# Altium project DAQBOXRev2.2026.PrjPcb
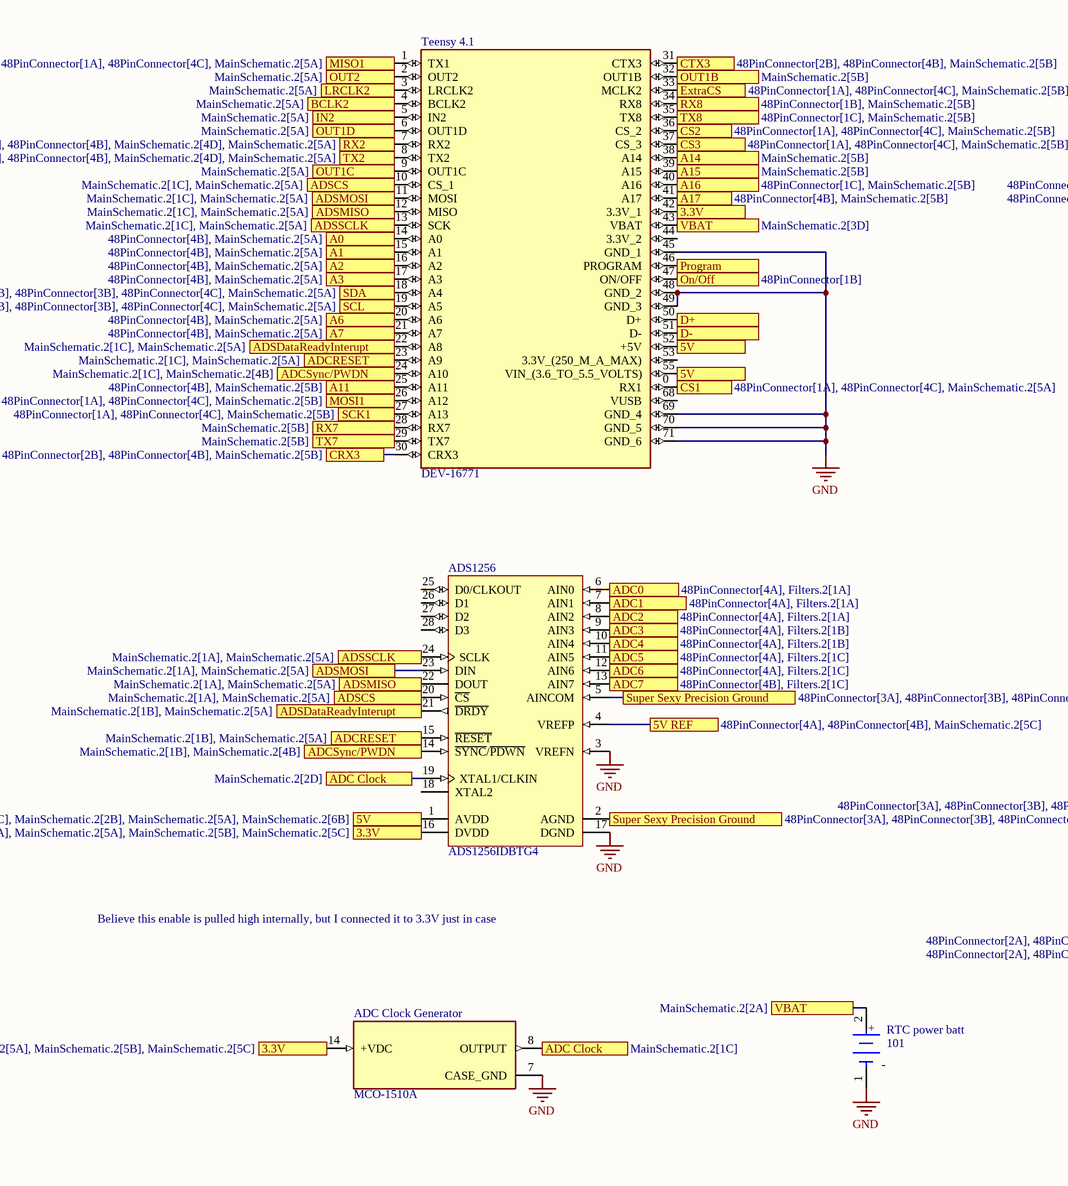
[diagram p0: MainSchematic.2.SchDoc, left]
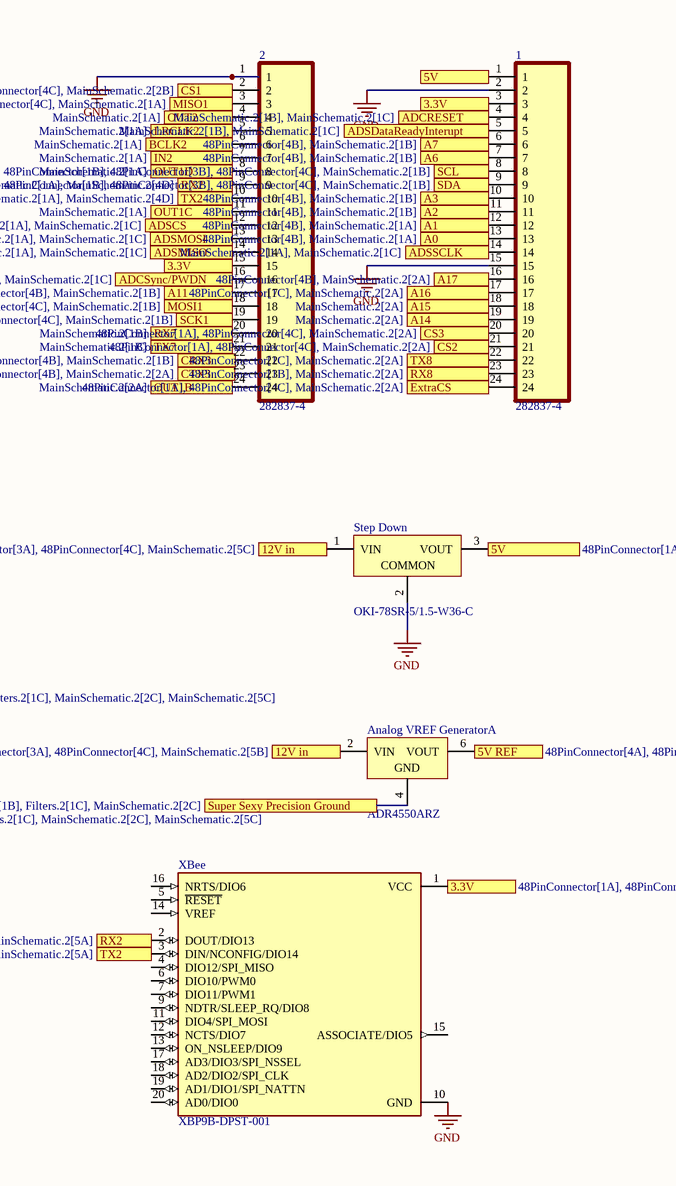
[diagram p1: MainSchematic.2.SchDoc, right]
3 sheets, 48 parts. Net scope: flat (ports and power ports of the same name join across sheets).
Board files: PCB2.FINAL.PcbDoc, PCB2.TEST.PcbDoc, PCB2.2.PcbDoc
Sheets:
  MainSchematic.2.SchDoc
  Filters.2.SchDoc
  48PinConnector.SchDoc

## Sheet MainSchematic.2.SchDoc
size OrCAD B; SheetNumber: 1; SheetTotal: 3

### Parts
1  282837-4  [TE_282837-4]
2  282837-4  [TE_282837-4]
ADC_Clock_Generator  MCO-1510A  [OSC_ECS-100AX-500]
ADS1256  ADS1256IDBTG4  [TI-DB28_L]
Analog_VREF_Generator  ADR4550ARZ  [ADI-R-8_N]  (part A of 2)
RTC_power_batt  101  [FP-101-MFG]
Step_Down  OKI-78SR-5/1.5-W36-C  [MURA-OKI-78SR-3]
Teensy_4.1  DEV-16771  [MODULE_DEV-16771]
XBee  XBP9B-DPST-001  [DIP2200W51P200L3294H279Q20P]

### Ports
3.3V (see 48PinConnector[1A], 48PinConnector[2B], 48PinConnector[2D], 48PinConnector[4C], MainSchematic.2[1C], MainSchematic.2[1D], MainSchematic.2[2A], MainSchematic.2[5A], MainSchematic.2[5B]), 3.3V (see 48PinConnector[1A], 48PinConnector[2B], 48PinConnector[2D], 48PinConnector[4C], MainSchematic.2[1C], MainSchematic.2[1D], MainSchematic.2[2A], MainSchematic.2[5A], MainSchematic.2[5C]), 3.3V (see 48PinConnector[1A], 48PinConnector[2B], 48PinConnector[2D], 48PinConnector[4C], MainSchematic.2[1C], MainSchematic.2[1D], MainSchematic.2[2A], MainSchematic.2[5B], MainSchematic.2[5C]), 3.3V (see 48PinConnector[1A], 48PinConnector[2B], 48PinConnector[2D], 48PinConnector[4C], MainSchematic.2[1C], MainSchematic.2[1D], MainSchematic.2[5A], MainSchematic.2[5B], MainSchematic.2[5C]), 3.3V (see 48PinConnector[1A], 48PinConnector[2B], 48PinConnector[2D], 48PinConnector[4C], MainSchematic.2[1C], MainSchematic.2[2A], MainSchematic.2[5A], MainSchematic.2[5B], MainSchematic.2[5C]), 3.3V (see 48PinConnector[1A], 48PinConnector[2B], 48PinConnector[2D], 48PinConnector[4C], MainSchematic.2[1D], MainSchematic.2[2A], MainSchematic.2[5A], MainSchematic.2[5B], MainSchematic.2[5C]), 5V (see 48PinConnector[1A], 48PinConnector[1B], 48PinConnector[1D], 48PinConnector[2A], 48PinConnector[3B], 48PinConnector[4B], 48PinConnector[4C], MainSchematic.2[1C], MainSchematic.2[2B], MainSchematic.2[5A]), 5V (see 48PinConnector[1A], 48PinConnector[1B], 48PinConnector[1D], 48PinConnector[2A], 48PinConnector[3B], 48PinConnector[4B], 48PinConnector[4C], MainSchematic.2[1C], MainSchematic.2[2B], MainSchematic.2[5A], MainSchematic.2[6B]), 5V (see 48PinConnector[1A], 48PinConnector[1B], 48PinConnector[1D], 48PinConnector[2A], 48PinConnector[3B], 48PinConnector[4B], 48PinConnector[4C], MainSchematic.2[1C], MainSchematic.2[2B], MainSchematic.2[6B]), 5V (see 48PinConnector[1A], 48PinConnector[1B], 48PinConnector[1D], 48PinConnector[2A], 48PinConnector[3B], 48PinConnector[4B], 48PinConnector[4C], MainSchematic.2[2B], MainSchematic.2[5A], MainSchematic.2[6B]), 5V REF (see 48PinConnector[4A], 48PinConnector[4B], MainSchematic.2[2C]), 5V REF (see 48PinConnector[4A], 48PinConnector[4B], MainSchematic.2[5C]), 12V in (see 48PinConnector[2D], 48PinConnector[3A], 48PinConnector[4C], MainSchematic.2[5B]), 12V in (see 48PinConnector[2D], 48PinConnector[3A], 48PinConnector[4C], MainSchematic.2[5C]), A0 (see 48PinConnector[4B], MainSchematic.2[1A]), A0 (see 48PinConnector[4B], MainSchematic.2[5A]), A1 (see 48PinConnector[4B], MainSchematic.2[1A]), A1 (see 48PinConnector[4B], MainSchematic.2[5A]), A2 (see 48PinConnector[4B], MainSchematic.2[1B]), A2 (see 48PinConnector[4B], MainSchematic.2[5A]), A3 (see 48PinConnector[4B], MainSchematic.2[1B]), A3 (see 48PinConnector[4B], MainSchematic.2[5A]), A6 (see 48PinConnector[4B], MainSchematic.2[1B]), A6 (see 48PinConnector[4B], MainSchematic.2[5A]), A7 (see 48PinConnector[4B], MainSchematic.2[1B]), A7 (see 48PinConnector[4B], MainSchematic.2[5A]), A11 (see 48PinConnector[4B], MainSchematic.2[1B]), A11 (see 48PinConnector[4B], MainSchematic.2[5B]), A14 (see MainSchematic.2[2A]), A14 (see MainSchematic.2[5B]), A15 (see MainSchematic.2[2A]), A15 (see MainSchematic.2[5B]), A16 (see 48PinConnector[1C], MainSchematic.2[2A]), A16 (see 48PinConnector[1C], MainSchematic.2[5B]), A17 (see 48PinConnector[4B], MainSchematic.2[2A]), A17 (see 48PinConnector[4B], MainSchematic.2[5B]), ADC0 (see 48PinConnector[4A], Filters.2[1A]), ADC1 (see 48PinConnector[4A], Filters.2[1A]), ADC2 (see 48PinConnector[4A], Filters.2[1A]), ADC3 (see 48PinConnector[4A], Filters.2[1B]), ADC4 (see 48PinConnector[4A], Filters.2[1B]), ADC5 (see 48PinConnector[4A], Filters.2[1C]), ADC6 (see 48PinConnector[4A], Filters.2[1C]), ADC7 (see 48PinConnector[4B], Filters.2[1C]), ADC Clock (see MainSchematic.2[1C]), ADC Clock (see MainSchematic.2[2D]), ADCRESET (see MainSchematic.2[1B], MainSchematic.2[1C]), ADCRESET (see MainSchematic.2[1B], MainSchematic.2[5A]), ADCRESET (see MainSchematic.2[1C], MainSchematic.2[5A]), ADCSync/PWDN (see MainSchematic.2[1B], MainSchematic.2[1C]), ADCSync/PWDN (see MainSchematic.2[1B], MainSchematic.2[4B]), ADCSync/PWDN (see MainSchematic.2[1C], MainSchematic.2[4B]), ADSCS (see MainSchematic.2[1A], MainSchematic.2[1C]), ADSCS (see MainSchematic.2[1A], MainSchematic.2[5A]), ADSCS (see MainSchematic.2[1C], MainSchematic.2[5A]), ADSDataReadyInterupt (see MainSchematic.2[1B], MainSchematic.2[1C]), ADSDataReadyInterupt (see MainSchematic.2[1B], MainSchematic.2[5A]), ADSDataReadyInterupt (see MainSchematic.2[1C], MainSchematic.2[5A]), ADSMISO (see MainSchematic.2[1A], MainSchematic.2[1C]), ADSMISO (see MainSchematic.2[1A], MainSchematic.2[5A]), ADSMISO (see MainSchematic.2[1C], MainSchematic.2[5A]), ADSMOSI (see MainSchematic.2[1A], MainSchematic.2[1C]), ADSMOSI (see MainSchematic.2[1A], MainSchematic.2[5A]), ADSMOSI (see MainSchematic.2[1C], MainSchematic.2[5A]), ADSSCLK (see MainSchematic.2[1A], MainSchematic.2[1C]), ADSSCLK (see MainSchematic.2[1A], MainSchematic.2[5A]), ADSSCLK (see MainSchematic.2[1C], MainSchematic.2[5A]), BCLK2 (see MainSchematic.2[1A]), BCLK2 (see MainSchematic.2[5A]), CRX3 (see 48PinConnector[2B], 48PinConnector[4B], MainSchematic.2[1B]), CRX3 (see 48PinConnector[2B], 48PinConnector[4B], MainSchematic.2[5B]), CS1 (see 48PinConnector[1A], 48PinConnector[4C], MainSchematic.2[2B]), CS1 (see 48PinConnector[1A], 48PinConnector[4C], MainSchematic.2[5A]), CS2 (see 48PinConnector[1A], 48PinConnector[4C], MainSchematic.2[2A]), CS2 (see 48PinConnector[1A], 48PinConnector[4C], MainSchematic.2[5B]), CS3 (see 48PinConnector[1A], 48PinConnector[4C], MainSchematic.2[2A]), CS3 (see 48PinConnector[1A], 48PinConnector[4C], MainSchematic.2[5B]), CTX3 (see 48PinConnector[2B], 48PinConnector[4B], MainSchematic.2[2A]), CTX3 (see 48PinConnector[2B], 48PinConnector[4B], MainSchematic.2[5B]), D+, D-, ExtraCS (see 48PinConnector[1A], 48PinConnector[4C], MainSchematic.2[2A]), ExtraCS (see 48PinConnector[1A], 48PinConnector[4C], MainSchematic.2[5B]), IN2 (see MainSchematic.2[1A]), IN2 (see MainSchematic.2[5A]), LRCLK2 (see MainSchematic.2[1A]), LRCLK2 (see MainSchematic.2[5A]), MISO1 (see 48PinConnector[1A], 48PinConnector[4C], MainSchematic.2[1A]), MISO1 (see 48PinConnector[1A], 48PinConnector[4C], MainSchematic.2[5A]), MOSI1 (see 48PinConnector[1A], 48PinConnector[4C], MainSchematic.2[1B]), MOSI1 (see 48PinConnector[1A], 48PinConnector[4C], MainSchematic.2[5B]), On/Off (see 48PinConnector[1B]), OUT1B (see MainSchematic.2[2A]), OUT1B (see MainSchematic.2[5B]), OUT1C (see MainSchematic.2[1A]), OUT1C (see MainSchematic.2[5A]), OUT1D (see MainSchematic.2[1A]), OUT1D (see MainSchematic.2[5A]), OUT2 (see MainSchematic.2[1A]), OUT2 (see MainSchematic.2[5A]), Program, RX2 (see 48PinConnector[2A], 48PinConnector[4B], MainSchematic.2[1A], MainSchematic.2[4D]), RX2 (see 48PinConnector[2A], 48PinConnector[4B], MainSchematic.2[1A], MainSchematic.2[5A]), RX2 (see 48PinConnector[2A], 48PinConnector[4B], MainSchematic.2[4D], MainSchematic.2[5A]), RX7 (see MainSchematic.2[1B]), RX7 (see MainSchematic.2[5B]), RX8 (see 48PinConnector[1B], MainSchematic.2[2A]), RX8 (see 48PinConnector[1B], MainSchematic.2[5B]), SCK1 (see 48PinConnector[1A], 48PinConnector[4C], MainSchematic.2[1B]), SCK1 (see 48PinConnector[1A], 48PinConnector[4C], MainSchematic.2[5B]), SCL (see 48PinConnector[1B], 48PinConnector[3B], 48PinConnector[4C], MainSchematic.2[1B]), SCL (see 48PinConnector[1B], 48PinConnector[3B], 48PinConnector[4C], MainSchematic.2[5A]), SDA (see 48PinConnector[1B], 48PinConnector[3B], 48PinConnector[4C], MainSchematic.2[1B]), SDA (see 48PinConnector[1B], 48PinConnector[3B], 48PinConnector[4C], MainSchematic.2[5A]), Super Sexy Precision Ground (see 48PinConnector[3A], 48PinConnector[3B], 48PinConnector[3C], Filters.2[1A], Filters.2[1B], Filters.2[1C], MainSchematic.2[2C]), Super Sexy Precision Ground (see 48PinConnector[3A], 48PinConnector[3B], 48PinConnector[3C], Filters.2[1A], Filters.2[1B], Filters.2[1C], MainSchematic.2[2C], MainSchematic.2[5C]), TX2 (see 48PinConnector[2A], 48PinConnector[4B], MainSchematic.2[1A], MainSchematic.2[4D]), TX2 (see 48PinConnector[2A], 48PinConnector[4B], MainSchematic.2[1A], MainSchematic.2[5A]), TX2 (see 48PinConnector[2A], 48PinConnector[4B], MainSchematic.2[4D], MainSchematic.2[5A]), TX7 (see MainSchematic.2[1B]), TX7 (see MainSchematic.2[5B]), TX8 (see 48PinConnector[1C], MainSchematic.2[2A]), TX8 (see 48PinConnector[1C], MainSchematic.2[5B]), VBAT (see MainSchematic.2[2A]), VBAT (see MainSchematic.2[3D])

### Nets
GND: 1.2 1.15 2.1 ADC_Clock_Generator.7(CASE_GND) ADS1256.3(VREFN) ADS1256.17(DGND) RTC_power_batt.1(C) Step_Down.2(COMMON) Teensy_4.1.45(GND_1) Teensy_4.1.48(GND_2) Teensy_4.1.49(GND_3) Teensy_4.1.69(GND_4) Teensy_4.1.70(GND_5) Teensy_4.1.71(GND_6) XBee.10(GND)
Net1_1: 1.1 ADS1256.1(AVDD) Step_Down.3(VOUT) Teensy_4.1.52(+5V) Teensy_4.1.55(VIN_(3.6_TO_5.5_VOLTS)) ; port 5V
Net1_3: 1.3 2.15 ADC_Clock_Generator.14(+VDC) ADS1256.16(DVDD) Teensy_4.1.42(3.3V_1) XBee.1(VCC) ; port 3.3V
Net1_4: 1.4 ADS1256.15(~{RESET}) Teensy_4.1.23(A9) ; port ADCRESET
Net1_5: 1.5 ADS1256.21(~{DRDY}) Teensy_4.1.22(A8) ; port ADSDataReadyInterupt
Net1_6: 1.6 Teensy_4.1.21(A7) ; port A7
Net1_7: 1.7 Teensy_4.1.20(A6) ; port A6
Net1_8: 1.8 Teensy_4.1.19(A5) ; port SCL
Net1_9: 1.9 Teensy_4.1.18(A4) ; port SDA
Net1_10: 1.10 Teensy_4.1.17(A3) ; port A3
Net1_11: 1.11 Teensy_4.1.16(A2) ; port A2
Net1_12: 1.12 Teensy_4.1.15(A1) ; port A1
Net1_13: 1.13 Teensy_4.1.14(A0) ; port A0
Net1_14: 1.14 ADS1256.24(SCLK) Teensy_4.1.13(SCK) ; port ADSSCLK
Net1_16: 1.16 Teensy_4.1.41(A17) ; port A17
Net1_17: 1.17 Teensy_4.1.40(A16) ; port A16
Net1_18: 1.18 Teensy_4.1.39(A15) ; port A15
Net1_19: 1.19 Teensy_4.1.38(A14) ; port A14
Net1_20: 1.20 Teensy_4.1.37(CS_3) ; port CS3
Net1_21: 1.21 Teensy_4.1.36(CS_2) ; port CS2
Net1_22: 1.22 Teensy_4.1.35(TX8) ; port TX8
Net1_23: 1.23 Teensy_4.1.34(RX8) ; port RX8
Net1_24: 1.24 Teensy_4.1.33(MCLK2) ; port ExtraCS
Net2_2: 2.2 Teensy_4.1.0(RX1) ; port CS1
Net2_3: 2.3 Teensy_4.1.1(TX1) ; port MISO1
Net2_4: 2.4 Teensy_4.1.2(OUT2) ; port OUT2
Net2_5: 2.5 Teensy_4.1.3(LRCLK2) ; port LRCLK2
Net2_6: 2.6 Teensy_4.1.4(BCLK2) ; port BCLK2
Net2_7: 2.7 Teensy_4.1.5(IN2) ; port IN2
Net2_8: 2.8 Teensy_4.1.6(OUT1D) ; port OUT1D
Net2_9: 2.9 Teensy_4.1.7(RX2) XBee.2(DOUT/DIO13) ; port RX2
Net2_10: 2.10 Teensy_4.1.8(TX2) XBee.3(DIN/NCONFIG/DIO14) ; port TX2
Net2_11: 2.11 Teensy_4.1.9(OUT1C) ; port OUT1C
Net2_12: 2.12 ADS1256.20(~{CS}) Teensy_4.1.10(CS_1) ; port ADSCS
Net2_13: 2.13 ADS1256.23(DIN) Teensy_4.1.11(MOSI) ; port ADSMOSI
Net2_14: 2.14 ADS1256.22(DOUT) Teensy_4.1.12(MISO) ; port ADSMISO
Net2_16: 2.16 ADS1256.14(~{SYNC}/~{PDWN}) Teensy_4.1.24(A10) ; port ADCSync/PWDN
Net2_17: 2.17 Teensy_4.1.25(A11) ; port A11
Net2_18: 2.18 Teensy_4.1.26(A12) ; port MOSI1
Net2_19: 2.19 Teensy_4.1.27(A13) ; port SCK1
Net2_20: 2.20 Teensy_4.1.28(RX7) ; port RX7
Net2_21: 2.21 Teensy_4.1.29(TX7) ; port TX7
Net2_24: 2.24 Teensy_4.1.32(OUT1B) ; port OUT1B
Net12V_1: Analog_VREF_Generator.2(VIN) Step_Down.1(VIN) ; port 12V in
Net48_Pin_Conn_A1: ADS1256.4(VREFP) Analog_VREF_Generator.6(VOUT) ; port 5V REF
Net48_Pin_Conn_A3: Teensy_4.1.30(CRX3) ; port CRX3
Net48_Pin_Conn_B1: ADS1256.2(AGND) ADS1256.5(AINCOM) Analog_VREF_Generator.4(GND) ; port Super Sexy Precision Ground
Net48_Pin_Conn_B3: Teensy_4.1.31(CTX3) ; port CTX3
Net48_Pin_Conn_C1: ADS1256.6(AIN0) ; port ADC0
Net48_Pin_Conn_D1: ADS1256.7(AIN1) ; port ADC1
Net48_Pin_Conn_E1: ADS1256.8(AIN2) ; port ADC2
Net48_Pin_Conn_F1: ADS1256.9(AIN3) ; port ADC3
Net48_Pin_Conn_G1: ADS1256.10(AIN4) ; port ADC4
Net48_Pin_Conn_H1: ADS1256.11(AIN5) ; port ADC5
Net48_Pin_Conn_J1: ADS1256.12(AIN6) ; port ADC6
Net48_Pin_Conn_K1: ADS1256.13(AIN7) ; port ADC7
NetADC_Clock_Generator_8: ADC_Clock_Generator.8(OUTPUT) ADS1256.19(XTAL1/CLKIN) ; port ADC Clock
NetI/O_1: Teensy_4.1.47(ON/OFF) ; port On/Off
NetRTC_power_batt_2: RTC_power_batt.2(A) Teensy_4.1.43(VBAT) ; port VBAT
NetTeensy_4.1_46: Teensy_4.1.46(PROGRAM) ; port Program
NetTeensy_4.1_50: Teensy_4.1.50(D+) ; port D+
NetTeensy_4.1_51: Teensy_4.1.51(D-) ; port D-

Not connected (* = marked no-connect by the designer): 2 22 23; ADS1256 18(XTAL2) 25(D0/CLKOUT) 26(D1) 27(D2) 28(D3); Teensy_4.1 44(3.3V_2) 53(3.3V_(250_M_A_MAX)) 68(VUSB); XBee 4(DIO12/SPI_MISO) 5(~{RESET}) 6(DIO10/PWM0) 7(DIO11/PWM1) 9(NDTR/SLEEP_RQ/DIO8) 11(DIO4/SPI_MOSI) 12(NCTS/DIO7) 13(ON_NSLEEP/DIO9) 14(VREF) 15(ASSOCIATE/DIO5) 16(NRTS/DIO6) 17(AD3/DIO3/SPI_NSSEL) 18(AD2/DIO2/SPI_CLK) 19(AD1/DIO1/SPI_NATTN) 20(AD0/DIO0)

### Notes on the sheet
- Believe this enable is pulled high internally, but I connected it to 3.3V just in case
- (in symbol CMP-19636-000018-1) +

### Library data of the parts
1 2 = 282837-4: 4 Position Wire to Board Terminal Block Horizontal with Board 0.200 (5.08mm) Through Hole; MF: TE Connectivity; Value: *; SnapEDA_Link: https://www.snapeda.com/parts/282837-4/TE+Connectivity+AMP+Connectors/view-part/?ref=snap; Purchase-URL: https://pricing.snapeda.com/search/part/282837-4/?ref=eda; EU_RoHS_Compliance: Compliant with Exemptions; Availability: In Stock; Price: None; Package: None; Check_prices: https://www.snapeda.com/parts/282837-4/TE+Connectivity+AMP+Connectors/view-part/?ref=eda; MP: 282837-4
ADC_Clock_Generator = ECS-100AX-500: Oscillator  14-DIP, 4 Leads (Full Size, Metal Can); Package: None; Price: None; Value: *; MP: ECS-100AX-500; Availability: Unavailable
ADS1256 = CMP-0003-00153-1: 24-Bit, 30 kSPS Very Low Noise Delta-Sigma ADC with Multiplexer, -40 to 85 degC, 28-pin SOP (DB28), Green (RoHS & no Sb/Br); Manufacturer: Texas Instruments; SubFamily: Precision ADC (<=10MSPS); Analog Voltage AV/DD(Min)(V): 4.75; Digital Supply(Max)(V): 3.6; Digital Supply(Min)(V): 1.8; Resolution(Bits): 24; Analog Voltage AV/DD(Max)(V): 5.25; Sample Rate (max)(SPS): 30k; # Input Channels: 8; Interface: Serial SPI; Mounting Technology: Surface Mount; Architecture: Delta-Sigma; DatasheetVersion: SBAS288J; ComponentLink3Description: Package Specification; Eco-Plan: Green (RoHS & no Sb/Br); Code_JEDEC: MO-150; PackageDescription: 28-Pin Plastic Small Outline, Body 10.2 X 5.3 mm, Pitch 0.65 mm; ComponentLink3URL: http://www.ti.com/lit/ml/msso002e/msso002e.pdf; ComponentLink1Description: Manufacturer URL; ComponentLink1URL: http://www.ti.com/; PartNumber: ADS1256IDBTG4; ComponentLink2URL: http://www.ti.com/general/docs/lit/getliterature.tsp?genericPartNumber=ADS1256&fileType=pdf; PackageReference: DB28; PackageVersion: 4040065/E, 12/2001; ComponentLink2Description: Datasheet
Analog_VREF_Generator = CMP-0784-00194-1: Ultralow Noise, High Accuracy Voltage Reference, 5 V Output, 3 to 15 V Supply, Industrial, 8-pin SOIC (R-8), Tube; Manufacturer: Analog Devices; Vout: 5V; Max V Supply (V): 15; Min V Supply (V): 3; Ref Out TC (ppm/C): 4; PackageReference: R-8; PackageDescription: 8-Pin Standard Small Outline Package, Body 4.9 x 3.9 mm, Pitch 1.27 mm; PackageVersion: 060506-A, 06/2006; Operating Temp Range: -40 to 125 degC; DatasheetVersion: Rev. 0; ComponentLink1URL: http://www.analog.com/en/index.html; PartNumber: ADR4550ARZ; Mounting Technology: Surface Mount; ComponentLink2URL: http://www.analog.com/static/imported-files/data_sheets/ADR4520_4525_4530_4533_4540_4550.pdf; ComponentLink2Description: Datasheet; ComponentLink3Description: Package Specification; ComponentLink3URL: http://www.analog.com/static/imported-files/packages/PKG_PDF/SOIC_Narrow%20(R)/R_8.pdf; Packing: Tube; ComponentLink1Description: Manufacturer URL; Code_JEDEC: MS-012-AA; ComponentLink4Description: URL Link1; ComponentLink4URL: Product URL:http://www.analog.com/en/special-linear-functions/voltage-references/adr4550/products/product.html
RTC_power_batt = CMP-19636-000018-1: BATTERY HOLDER COIN 20MM PC PIN; Body Material: PBT; Number of Batteries: 1; Packaging: Bag; Lead Free: Lead Free; Package Quantity: 1; Contact Plating: Tin; Termination: PC Pin; REACH SVHC: No SVHC; Material: Steel; Mount: Through Hole; Max Operating Temperature: 145°C; Min Operating Temperature: -50°C; Number of Cells: 1; Series: -
Step_Down = CMP-2000-05274-1: Non-Isolated DC/DC Converter, 7.5 W, 7 to 36 V, 1.5 A, -40 to 85 degC, 3-Pin THD, RoHS; Manufacturer: Murata; Current - Output (Max): 1.5A; Power (Watts) - Max: 8W; Efficiency: 90.5%; Voltage - Input (Min): 7V; Voltage - Input (Max): 36V; Voltage - Output 1: 5V; Number of Outputs: 1; Package / Case: 3-SIPModule; Features: SCP; Type: LinearRegulatorReplacement; Size / Dimension: 0.41"Lx0.30"Wx0.65"H(10.4mmx7.6mmx16.5mm); Datasheet URL: https://datasheet.ciiva.com/8006/1790439-8006672.pdf; Datasheet Version: Oct-13; Power (Watts) - Manufacture Series: 8W; Voltage - Output 2: -; Series: Okami™OKI-78SR; Family: DCDCConverters; Manufacturer URL: http://www.murata.com/; Category: PowerSupplies-BoardMount; Voltage - Isolation: -; Packaging: Tube; Applications: ITE(Commercial); Mounting Type: ThroughHole; Voltage - Output 3: -; Operating Temperature: -40degC~85degC
Teensy_4.1 = CMP-003-000000-1: RT1062 Teensy 4.1 series ARM?Cortex?M7 MPU Embedded Evaluation Board; MF: SparkFun Electronics; SnapEDA_Link: https://www.snapeda.com/parts/DEV-16771/SparkFun+Electronics/view-part/?ref=snap; Package: None; Value: *; MP: DEV-16771; Check_prices: https://www.snapeda.com/parts/DEV-16771/SparkFun+Electronics/view-part/?ref=eda
XBee = XBP9B-DPST-001: General ISM < 1GHz - Transceiver Module 900MHz Antenna Not Included, RP-SMA Through Hole; MF: Digi International; SnapEDA_Link: https://www.snapeda.com/parts/XBP9B-DPST-001/Digi+International/view-part/?ref=snap; Package: Module Digi International; Value: *; MP: XBP9B-DPST-001; Check_prices: https://www.snapeda.com/parts/XBP9B-DPST-001/Digi+International/view-part/?ref=eda

## Sheet Filters.2.SchDoc
size A; SheetNumber: 2; SheetTotal: 3
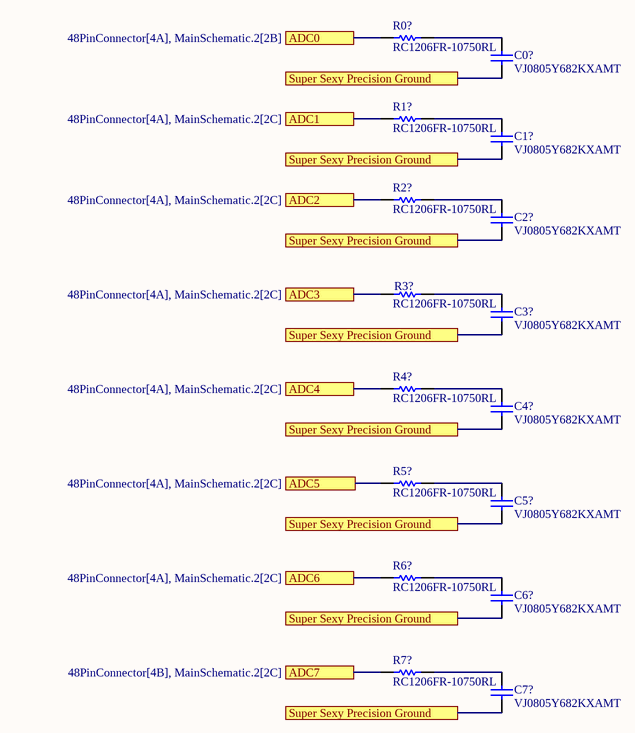
[diagram p2: Filters.2.SchDoc]

### Parts
C0?  VJ0805Y682KXAMT  [CAPC2013X145X48ML20T23]
C1?  VJ0805Y682KXAMT  [CAPC2013X145X48ML20T23]
C2?  VJ0805Y682KXAMT  [CAPC2013X145X48ML20T23]
C3?  VJ0805Y682KXAMT  [CAPC2013X145X48ML20T23]
C4?  VJ0805Y682KXAMT  [CAPC2013X145X48ML20T23]
C5?  VJ0805Y682KXAMT  [CAPC2013X145X48ML20T23]
C6?  VJ0805Y682KXAMT  [CAPC2013X145X48ML20T23]
C7?  VJ0805Y682KXAMT  [CAPC2013X145X48ML20T23]
R0?  RC1206FR-10750RL  [RESC3116X65X40LL10T20]
R1?  RC1206FR-10750RL  [RESC3116X65X40LL10T20]
R2?  RC1206FR-10750RL  [RESC3116X65X40LL10T20]
R3?  RC1206FR-10750RL  [RESC3116X65X40LL10T20]
R4?  RC1206FR-10750RL  [RESC3116X65X40LL10T20]
R5?  RC1206FR-10750RL  [RESC3116X65X40LL10T20]
R6?  RC1206FR-10750RL  [RESC3116X65X40LL10T20]
R7?  RC1206FR-10750RL  [RESC3116X65X40LL10T20]

### Ports
ADC0 (see 48PinConnector[4A], MainSchematic.2[2B]), ADC1 (see 48PinConnector[4A], MainSchematic.2[2C]), ADC2 (see 48PinConnector[4A], MainSchematic.2[2C]), ADC3 (see 48PinConnector[4A], MainSchematic.2[2C]), ADC4 (see 48PinConnector[4A], MainSchematic.2[2C]), ADC5 (see 48PinConnector[4A], MainSchematic.2[2C]), ADC6 (see 48PinConnector[4A], MainSchematic.2[2C]), ADC7 (see 48PinConnector[4B], MainSchematic.2[2C]), Super Sexy Precision Ground (see 48PinConnector[3A], 48PinConnector[3B], 48PinConnector[3C], Filters.2[1A], Filters.2[1B], Filters.2[1C], MainSchematic.2[2C], MainSchematic.2[5B])

### Nets
Net48_Pin_Conn_B1: C0?.1 C1?.1 C2?.1 C3?.1 C4?.1 C5?.1 C6?.1 C7?.1 ; port Super Sexy Precision Ground
Net48_Pin_Conn_C1: R0?.1 ; port ADC0
Net48_Pin_Conn_D1: R1?.1 ; port ADC1
Net48_Pin_Conn_E1: R2?.1 ; port ADC2
Net48_Pin_Conn_F1: R3?.1 ; port ADC3
Net48_Pin_Conn_G1: R4?.1 ; port ADC4
Net48_Pin_Conn_H1: R5?.1 ; port ADC5
Net48_Pin_Conn_J1: R6?.1 ; port ADC6
Net48_Pin_Conn_K1: R7?.1 ; port ADC7
NetC0?_2: C0?.2 R0?.2
NetC1?_2: C1?.2 R1?.2
NetC2?_2: C2?.2 R2?.2
NetC3?_2: C3?.2 R3?.2
NetC4?_2: C4?.2 R4?.2
NetC5?_2: C5?.2 R5?.2
NetC6?_2: C6?.2 R6?.2
NetC7?_2: C7?.2 R7?.2

### Library data of the parts
C0? C1? C2? C3? C4? C5? C6? C7? = CMP-2007-03205-1: Manufacturer: Vitramon; Part Number: VJ0805Y682KXAMT
R0? R1? R2? R3? R4? R5? R6? R7? = CMP-2003-04964-1: Manufacturer: Yageo; Part Number: RC1206FR-10750RL

## Sheet 48PinConnector.SchDoc
size A; SheetNumber: 3; SheetTotal: 3
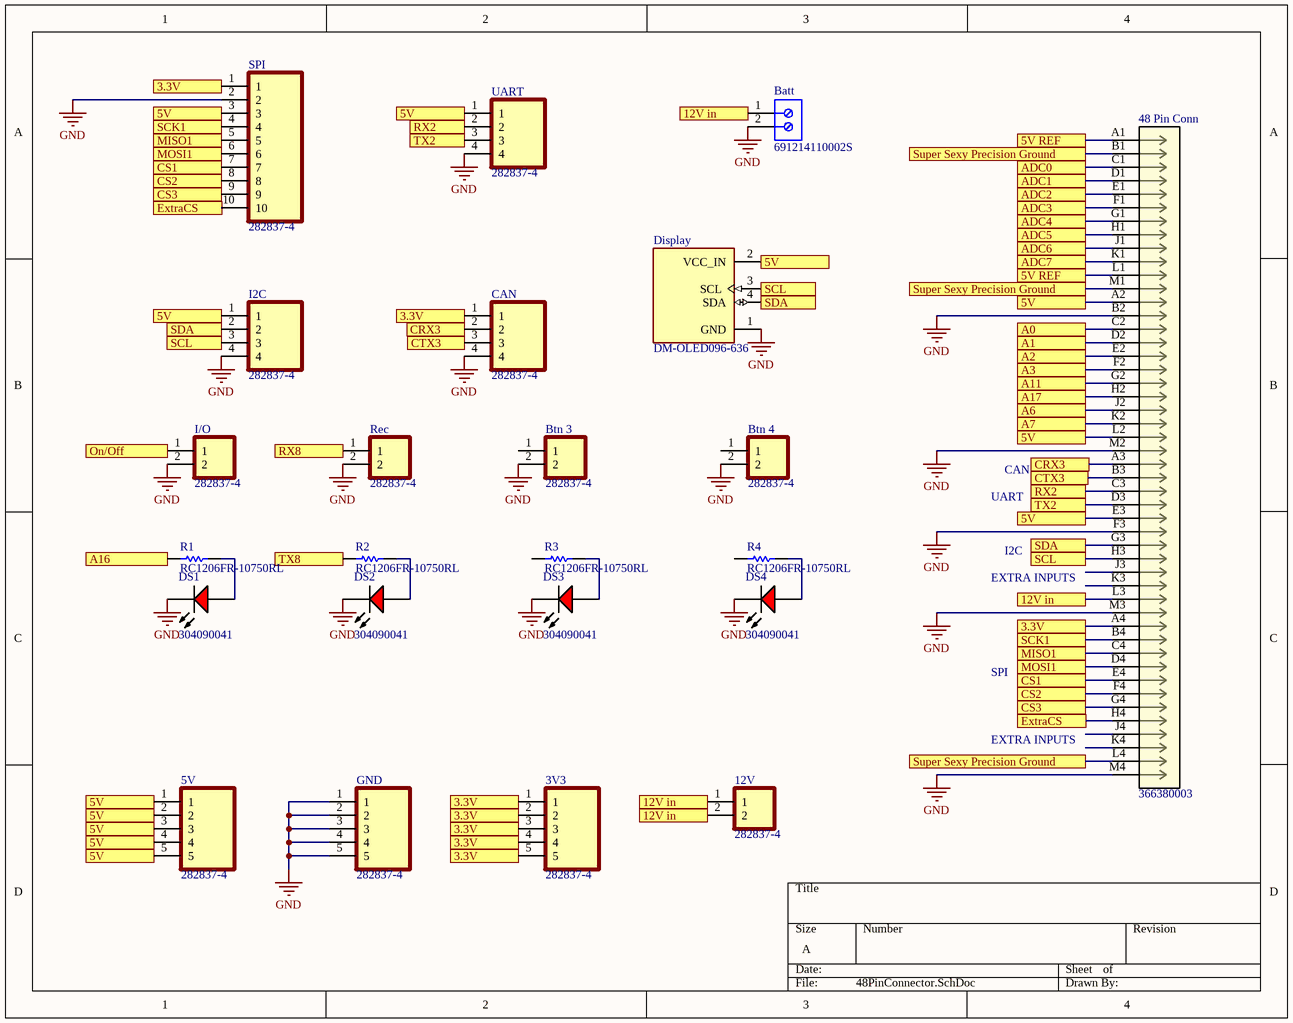
[diagram p3: 48PinConnector.SchDoc]

### Parts
3V3  282837-4  [TE_282837-4]
5V  282837-4  [TE_282837-4]
12V  282837-4  [TE_282837-4]
48_Pin_Conn  366380003  [CONN_36638-0003_MOL]
Batt  691214110002S  [691214110002S]
Btn_3  282837-4  [TE_282837-4]
Btn_4  282837-4  [TE_282837-4]
CAN  282837-4  [TE_282837-4]
Display  DM-OLED096-636  [MODULE_DM-OLED096-636]
DS1  304090041  [LED-2P-2.28-3MM_A]
DS2  304090041  [LED-2P-2.28-3MM_A]
DS3  304090041  [LED-2P-2.28-3MM_A]
DS4  304090041  [LED-2P-2.28-3MM_A]
GND  282837-4  [TE_282837-4]
I2C  282837-4  [TE_282837-4]
I/O  282837-4  [TE_282837-4]
R1  RC1206FR-10750RL  [RESC3116X65X40LL10T20]
R2  RC1206FR-10750RL  [RESC3116X65X40LL10T20]
R3  RC1206FR-10750RL  [RESC3116X65X40LL10T20]
R4  RC1206FR-10750RL  [RESC3116X65X40LL10T20]
Rec  282837-4  [TE_282837-4]
SPI  282837-4  [TE_282837-4]
UART  282837-4  [TE_282837-4]

### Ports
3.3V (see 48PinConnector[1A], 48PinConnector[2B], 48PinConnector[2D], 48PinConnector[4C], MainSchematic.2[1C], MainSchematic.2[1D], MainSchematic.2[2A], MainSchematic.2[5A], MainSchematic.2[5B], MainSchematic.2[5C]), 3.3V (see 48PinConnector[1A], 48PinConnector[2B], 48PinConnector[2D], MainSchematic.2[1C], MainSchematic.2[1D], MainSchematic.2[2A], MainSchematic.2[5A], MainSchematic.2[5B], MainSchematic.2[5C]), 3.3V (see 48PinConnector[1A], 48PinConnector[2D], 48PinConnector[4C], MainSchematic.2[1C], MainSchematic.2[1D], MainSchematic.2[2A], MainSchematic.2[5A], MainSchematic.2[5B], MainSchematic.2[5C]), 3.3V (see 48PinConnector[2B], 48PinConnector[2D], 48PinConnector[4C], MainSchematic.2[1C], MainSchematic.2[1D], MainSchematic.2[2A], MainSchematic.2[5A], MainSchematic.2[5B], MainSchematic.2[5C]), 5V (see 48PinConnector[1A], 48PinConnector[1B], 48PinConnector[1D], 48PinConnector[2A], 48PinConnector[3B], 48PinConnector[4B], 48PinConnector[4C], MainSchematic.2[1C], MainSchematic.2[2B], MainSchematic.2[5A], MainSchematic.2[6B]), 5V (see 48PinConnector[1A], 48PinConnector[1B], 48PinConnector[1D], 48PinConnector[2A], 48PinConnector[3B], 48PinConnector[4B], MainSchematic.2[1C], MainSchematic.2[2B], MainSchematic.2[5A], MainSchematic.2[6B]), 5V (see 48PinConnector[1A], 48PinConnector[1B], 48PinConnector[1D], 48PinConnector[2A], 48PinConnector[4B], 48PinConnector[4C], MainSchematic.2[1C], MainSchematic.2[2B], MainSchematic.2[5A], MainSchematic.2[6B]), 5V (see 48PinConnector[1A], 48PinConnector[1B], 48PinConnector[1D], 48PinConnector[3B], 48PinConnector[4B], 48PinConnector[4C], MainSchematic.2[1C], MainSchematic.2[2B], MainSchematic.2[5A], MainSchematic.2[6B]), 5V (see 48PinConnector[1A], 48PinConnector[1D], 48PinConnector[2A], 48PinConnector[3B], 48PinConnector[4B], 48PinConnector[4C], MainSchematic.2[1C], MainSchematic.2[2B], MainSchematic.2[5A], MainSchematic.2[6B]), 5V (see 48PinConnector[1B], 48PinConnector[1D], 48PinConnector[2A], 48PinConnector[3B], 48PinConnector[4B], 48PinConnector[4C], MainSchematic.2[1C], MainSchematic.2[2B], MainSchematic.2[5A], MainSchematic.2[6B]), 5V REF (see 48PinConnector[4A], MainSchematic.2[2C], MainSchematic.2[5C]), 5V REF (see 48PinConnector[4B], MainSchematic.2[2C], MainSchematic.2[5C]), 12V in (see 48PinConnector[2D], 48PinConnector[3A], 48PinConnector[4C], MainSchematic.2[5B], MainSchematic.2[5C]), 12V in (see 48PinConnector[2D], 48PinConnector[3A], MainSchematic.2[5B], MainSchematic.2[5C]), 12V in (see 48PinConnector[2D], 48PinConnector[4C], MainSchematic.2[5B], MainSchematic.2[5C]), A0 (see MainSchematic.2[1A], MainSchematic.2[5A]), A1 (see MainSchematic.2[1A], MainSchematic.2[5A]), A2 (see MainSchematic.2[1B], MainSchematic.2[5A]), A3 (see MainSchematic.2[1B], MainSchematic.2[5A]), A6 (see MainSchematic.2[1B], MainSchematic.2[5A]), A7 (see MainSchematic.2[1B], MainSchematic.2[5A]), A11 (see MainSchematic.2[1B], MainSchematic.2[5B]), A16 (see MainSchematic.2[2A], MainSchematic.2[5B]), A17 (see MainSchematic.2[2A], MainSchematic.2[5B]), ADC0 (see Filters.2[1A], MainSchematic.2[2B]), ADC1 (see Filters.2[1A], MainSchematic.2[2C]), ADC2 (see Filters.2[1A], MainSchematic.2[2C]), ADC3 (see Filters.2[1B], MainSchematic.2[2C]), ADC4 (see Filters.2[1B], MainSchematic.2[2C]), ADC5 (see Filters.2[1C], MainSchematic.2[2C]), ADC6 (see Filters.2[1C], MainSchematic.2[2C]), ADC7 (see Filters.2[1C], MainSchematic.2[2C]), CRX3 (see 48PinConnector[2B], MainSchematic.2[1B], MainSchematic.2[5B]), CRX3 (see 48PinConnector[4B], MainSchematic.2[1B], MainSchematic.2[5B]), CS1 (see 48PinConnector[1A], MainSchematic.2[2B], MainSchematic.2[5A]), CS1 (see 48PinConnector[4C], MainSchematic.2[2B], MainSchematic.2[5A]), CS2 (see 48PinConnector[1A], MainSchematic.2[2A], MainSchematic.2[5B]), CS2 (see 48PinConnector[4C], MainSchematic.2[2A], MainSchematic.2[5B]), CS3 (see 48PinConnector[1A], MainSchematic.2[2A], MainSchematic.2[5B]), CS3 (see 48PinConnector[4C], MainSchematic.2[2A], MainSchematic.2[5B]), CTX3 (see 48PinConnector[2B], MainSchematic.2[2A], MainSchematic.2[5B]), CTX3 (see 48PinConnector[4B], MainSchematic.2[2A], MainSchematic.2[5B]), ExtraCS (see 48PinConnector[1A], MainSchematic.2[2A], MainSchematic.2[5B]), ExtraCS (see 48PinConnector[4C], MainSchematic.2[2A], MainSchematic.2[5B]), MISO1 (see 48PinConnector[1A], MainSchematic.2[1A], MainSchematic.2[5A]), MISO1 (see 48PinConnector[4C], MainSchematic.2[1A], MainSchematic.2[5A]), MOSI1 (see 48PinConnector[1A], MainSchematic.2[1B], MainSchematic.2[5B]), MOSI1 (see 48PinConnector[4C], MainSchematic.2[1B], MainSchematic.2[5B]), On/Off (see MainSchematic.2[2B]), RX2 (see 48PinConnector[2A], MainSchematic.2[1A], MainSchematic.2[4D], MainSchematic.2[5A]), RX2 (see 48PinConnector[4B], MainSchematic.2[1A], MainSchematic.2[4D], MainSchematic.2[5A]), RX8 (see MainSchematic.2[2A], MainSchematic.2[5B]), SCK1 (see 48PinConnector[1A], MainSchematic.2[1B], MainSchematic.2[5B]), SCK1 (see 48PinConnector[4C], MainSchematic.2[1B], MainSchematic.2[5B]), SCL (see 48PinConnector[1B], 48PinConnector[3B], MainSchematic.2[1B], MainSchematic.2[5A]), SCL (see 48PinConnector[1B], 48PinConnector[4C], MainSchematic.2[1B], MainSchematic.2[5A]), SCL (see 48PinConnector[3B], 48PinConnector[4C], MainSchematic.2[1B], MainSchematic.2[5A]), SDA (see 48PinConnector[1B], 48PinConnector[3B], MainSchematic.2[1B], MainSchematic.2[5A]), SDA (see 48PinConnector[1B], 48PinConnector[4C], MainSchematic.2[1B], MainSchematic.2[5A]), SDA (see 48PinConnector[3B], 48PinConnector[4C], MainSchematic.2[1B], MainSchematic.2[5A]), Super Sexy Precision Ground (see 48PinConnector[3A], 48PinConnector[3B], Filters.2[1A], Filters.2[1B], Filters.2[1C], MainSchematic.2[2C], MainSchematic.2[5C]), Super Sexy Precision Ground (see 48PinConnector[3A], 48PinConnector[3C], Filters.2[1A], Filters.2[1B], Filters.2[1C], MainSchematic.2[2C], MainSchematic.2[5C]), Super Sexy Precision Ground (see 48PinConnector[3B], 48PinConnector[3C], Filters.2[1A], Filters.2[1B], Filters.2[1C], MainSchematic.2[2C], MainSchematic.2[5C]), TX2 (see 48PinConnector[2A], MainSchematic.2[1A], MainSchematic.2[4D], MainSchematic.2[5A]), TX2 (see 48PinConnector[4B], MainSchematic.2[1A], MainSchematic.2[4D], MainSchematic.2[5A]), TX8 (see MainSchematic.2[2A], MainSchematic.2[5B])

### Nets
GND: 48_Pin_Conn.B2 48_Pin_Conn.F3 48_Pin_Conn.M2 48_Pin_Conn.M3 48_Pin_Conn.M4 Batt.2 Btn_3.2 Btn_4.2 CAN.4 Display.1(GND) DS1.2(K) DS2.2(K) DS3.2(K) DS4.2(K) GND.1 GND.2 GND.3 GND.4 GND.5 I2C.4 I/O.2 Rec.2 SPI.2 UART.4
Net1_1: 5V.1 5V.2 5V.3 5V.4 5V.5 48_Pin_Conn.A2 48_Pin_Conn.E3 48_Pin_Conn.L2 Display.2(VCC_IN) I2C.1 SPI.3 UART.1 ; port 5V
Net1_3: 3V3.1 3V3.2 3V3.3 3V3.4 3V3.5 48_Pin_Conn.A4 CAN.1 SPI.1 ; port 3.3V
Net1_6: 48_Pin_Conn.K2 ; port A7
Net1_7: 48_Pin_Conn.J2 ; port A6
Net1_8: 48_Pin_Conn.H3 Display.3(SCL) I2C.3 ; port SCL
Net1_9: 48_Pin_Conn.G3 Display.4(SDA) I2C.2 ; port SDA
Net1_10: 48_Pin_Conn.F2 ; port A3
Net1_11: 48_Pin_Conn.E2 ; port A2
Net1_12: 48_Pin_Conn.D2 ; port A1
Net1_13: 48_Pin_Conn.C2 ; port A0
Net1_16: 48_Pin_Conn.H2 ; port A17
Net1_17: R1.1 ; port A16
Net1_20: 48_Pin_Conn.G4 SPI.9 ; port CS3
Net1_21: 48_Pin_Conn.F4 SPI.8 ; port CS2
Net1_22: R2.1 ; port TX8
Net1_23: Rec.1 ; port RX8
Net1_24: 48_Pin_Conn.H4 SPI.10 ; port ExtraCS
Net2_2: 48_Pin_Conn.E4 SPI.7 ; port CS1
Net2_3: 48_Pin_Conn.C4 SPI.5 ; port MISO1
Net2_9: 48_Pin_Conn.C3 UART.2 ; port RX2
Net2_10: 48_Pin_Conn.D3 UART.3 ; port TX2
Net2_17: 48_Pin_Conn.G2 ; port A11
Net2_18: 48_Pin_Conn.D4 SPI.6 ; port MOSI1
Net2_19: 48_Pin_Conn.B4 SPI.4 ; port SCK1
Net12V_1: 12V.1 12V.2 48_Pin_Conn.L3 Batt.1 ; port 12V in
Net48_Pin_Conn_A1: 48_Pin_Conn.A1 48_Pin_Conn.L1 ; port 5V REF
Net48_Pin_Conn_A3: 48_Pin_Conn.A3 CAN.2 ; port CRX3
Net48_Pin_Conn_B1: 48_Pin_Conn.B1 48_Pin_Conn.L4 48_Pin_Conn.M1 ; port Super Sexy Precision Ground
Net48_Pin_Conn_B3: 48_Pin_Conn.B3 CAN.3 ; port CTX3
Net48_Pin_Conn_C1: 48_Pin_Conn.C1 ; port ADC0
Net48_Pin_Conn_D1: 48_Pin_Conn.D1 ; port ADC1
Net48_Pin_Conn_E1: 48_Pin_Conn.E1 ; port ADC2
Net48_Pin_Conn_F1: 48_Pin_Conn.F1 ; port ADC3
Net48_Pin_Conn_G1: 48_Pin_Conn.G1 ; port ADC4
Net48_Pin_Conn_H1: 48_Pin_Conn.H1 ; port ADC5
Net48_Pin_Conn_J1: 48_Pin_Conn.J1 ; port ADC6
Net48_Pin_Conn_K1: 48_Pin_Conn.K1 ; port ADC7
NetDS1_1: DS1.1(A) R1.2
NetDS2_1: DS2.1(A) R2.2
NetDS3_1: DS3.1(A) R3.2
NetDS4_1: DS4.1(A) R4.2
NetI/O_1: I/O.1 ; port On/Off

Not connected (* = marked no-connect by the designer): 48_Pin_Conn J3 J4 K3 K4; Btn_3 1; Btn_4 1; R3 1; R4 1

### Notes on the sheet
- UART
- CAN
- I2C
- EXTRA INPUTS
- SPI

### Library data of the parts
3V3 5V 12V Btn_3 Btn_4 CAN GND I2C I/O Rec SPI UART = 282837-4: as 1 on sheet MainSchematic.2; Value: *; SnapEDA_Link: https://www.snapeda.com/parts/282837-4/TE+Connectivity+AMP+Connectors/view-part/?ref=snap; Purchase-URL: https://pricing.snapeda.com/search/part/282837-4/?ref=eda; EU_RoHS_Compliance: Compliant with Exemptions; Availability: In Stock; Price: None; Package: None; Check_prices: https://www.snapeda.com/parts/282837-4/TE+Connectivity+AMP+Connectors/view-part/?ref=eda; MP: 282837-4
48_Pin_Conn = 366380003: 2.50mm, 3.50mm CMC Header, Right-Angle, 48 Position, 1 Port, Brown, Peg,  Lead-Free; Manufacturer_Name: Molex Connector Corporation; Copyright: Copyright (C) 2025 Ultra Librarian. All rights reserved.; Manufacturer_Part_Number: 366380003; RefDes: RefDes; Type: Type
Batt = CMP-1502-02465-2: NexarPartId: 94172715; Voltage Rating: 300V; Number of Contacts: 2; Current Rating: 10A; Lead Pitch: 3.5mm; Height: 9.2mm; Min Operating Temperature: -30°C; Number of Pins: 2; Packaging: Box; Max Operating Temperature: 120°C; Contact Material: Nickel, Tin; Number of Rows: 1
Display = DM-OLED096-636: 0.96â€ 128 X 64 MONOCHROME GRAPHIC OLED DISPLAY MODULE - I2C; SnapEDA_Link: https://www.snapeda.com/parts/DM-OLED096-636/Display+Module/view-part/?ref=snap; Package: Package; Value: *; MF: Display Module; MP: DM-OLED096-636; Check_prices: https://www.snapeda.com/parts/DM-OLED096-636/Display+Module/view-part/?ref=eda
DS1-DS4 = CMP-007-00007-2: Red LED, 80 mW, 30 mA, -25 to 85 degC, 2-Pin THD; Manufacturer: Shenzhen CGX; Package Description: 2-Pin Through Hole Device, Dia 3 mm, Pitch 2.28 mm; Datasheet URL: http://datasheet.octopart.com/304090041-Chengguangxing-datasheet-62330656.pdf; Mounting Technology: TH; Manufacturer URL: http://szcgx.com/; RoHS Compliant: Unknown; Datasheet Version: Sep-14; Case/Package: 304090041; Package Reference: 304090041
R1-R4 = CMP-2003-04964-1: Manufacturer: Yageo; Part Number: RC1206FR-10750RL

## Nets that join several sheets
GND: MainSchematic.2 (15 pins), 48PinConnector (24 pins)
Net1_1: MainSchematic.2 (5 pins), 48PinConnector (12 pins)
Net1_3: MainSchematic.2 (6 pins), 48PinConnector (8 pins)
Net1_6: MainSchematic.2 (1.6 Teensy_4.1.21), 48PinConnector (48_Pin_Conn.K2)
Net1_7: MainSchematic.2 (1.7 Teensy_4.1.20), 48PinConnector (48_Pin_Conn.J2)
Net1_8: MainSchematic.2 (1.8 Teensy_4.1.19), 48PinConnector (48_Pin_Conn.H3 Display.3 I2C.3)
Net1_9: MainSchematic.2 (1.9 Teensy_4.1.18), 48PinConnector (48_Pin_Conn.G3 Display.4 I2C.2)
Net1_10: MainSchematic.2 (1.10 Teensy_4.1.17), 48PinConnector (48_Pin_Conn.F2)
Net1_11: MainSchematic.2 (1.11 Teensy_4.1.16), 48PinConnector (48_Pin_Conn.E2)
Net1_12: MainSchematic.2 (1.12 Teensy_4.1.15), 48PinConnector (48_Pin_Conn.D2)
Net1_13: MainSchematic.2 (1.13 Teensy_4.1.14), 48PinConnector (48_Pin_Conn.C2)
Net1_16: MainSchematic.2 (1.16 Teensy_4.1.41), 48PinConnector (48_Pin_Conn.H2)
Net1_17: MainSchematic.2 (1.17 Teensy_4.1.40), 48PinConnector (R1.1)
Net1_20: MainSchematic.2 (1.20 Teensy_4.1.37), 48PinConnector (48_Pin_Conn.G4 SPI.9)
Net1_21: MainSchematic.2 (1.21 Teensy_4.1.36), 48PinConnector (48_Pin_Conn.F4 SPI.8)
Net1_22: MainSchematic.2 (1.22 Teensy_4.1.35), 48PinConnector (R2.1)
Net1_23: MainSchematic.2 (1.23 Teensy_4.1.34), 48PinConnector (Rec.1)
Net1_24: MainSchematic.2 (1.24 Teensy_4.1.33), 48PinConnector (48_Pin_Conn.H4 SPI.10)
Net2_2: MainSchematic.2 (2.2 Teensy_4.1.0), 48PinConnector (48_Pin_Conn.E4 SPI.7)
Net2_3: MainSchematic.2 (2.3 Teensy_4.1.1), 48PinConnector (48_Pin_Conn.C4 SPI.5)
Net2_9: MainSchematic.2 (2.9 Teensy_4.1.7 XBee.2), 48PinConnector (48_Pin_Conn.C3 UART.2)
Net2_10: MainSchematic.2 (2.10 Teensy_4.1.8 XBee.3), 48PinConnector (48_Pin_Conn.D3 UART.3)
Net2_17: MainSchematic.2 (2.17 Teensy_4.1.25), 48PinConnector (48_Pin_Conn.G2)
Net2_18: MainSchematic.2 (2.18 Teensy_4.1.26), 48PinConnector (48_Pin_Conn.D4 SPI.6)
Net2_19: MainSchematic.2 (2.19 Teensy_4.1.27), 48PinConnector (48_Pin_Conn.B4 SPI.4)
Net12V_1: MainSchematic.2 (Analog_VREF_Generator.2 Step_Down.1), 48PinConnector (12V.1 12V.2 48_Pin_Conn.L3 Batt.1)
Net48_Pin_Conn_A1: MainSchematic.2 (ADS1256.4 Analog_VREF_Generator.6), 48PinConnector (48_Pin_Conn.A1 48_Pin_Conn.L1)
Net48_Pin_Conn_A3: MainSchematic.2 (Teensy_4.1.30), 48PinConnector (48_Pin_Conn.A3 CAN.2)
Net48_Pin_Conn_B1: MainSchematic.2 (ADS1256.2 ADS1256.5 Analog_VREF_Generator.4), Filters.2 (8 pins), 48PinConnector (48_Pin_Conn.B1 48_Pin_Conn.L4 48_Pin_Conn.M1)
Net48_Pin_Conn_B3: MainSchematic.2 (Teensy_4.1.31), 48PinConnector (48_Pin_Conn.B3 CAN.3)
Net48_Pin_Conn_C1: MainSchematic.2 (ADS1256.6), Filters.2 (R0?.1), 48PinConnector (48_Pin_Conn.C1)
Net48_Pin_Conn_D1: MainSchematic.2 (ADS1256.7), Filters.2 (R1?.1), 48PinConnector (48_Pin_Conn.D1)
Net48_Pin_Conn_E1: MainSchematic.2 (ADS1256.8), Filters.2 (R2?.1), 48PinConnector (48_Pin_Conn.E1)
Net48_Pin_Conn_F1: MainSchematic.2 (ADS1256.9), Filters.2 (R3?.1), 48PinConnector (48_Pin_Conn.F1)
Net48_Pin_Conn_G1: MainSchematic.2 (ADS1256.10), Filters.2 (R4?.1), 48PinConnector (48_Pin_Conn.G1)
Net48_Pin_Conn_H1: MainSchematic.2 (ADS1256.11), Filters.2 (R5?.1), 48PinConnector (48_Pin_Conn.H1)
Net48_Pin_Conn_J1: MainSchematic.2 (ADS1256.12), Filters.2 (R6?.1), 48PinConnector (48_Pin_Conn.J1)
Net48_Pin_Conn_K1: MainSchematic.2 (ADS1256.13), Filters.2 (R7?.1), 48PinConnector (48_Pin_Conn.K1)
NetI/O_1: MainSchematic.2 (Teensy_4.1.47), 48PinConnector (I/O.1)